# EasyEDA Pro project ProPrj_smartmower_2025-07-31_08-52-16_2025-10-22.epro, board smartmower
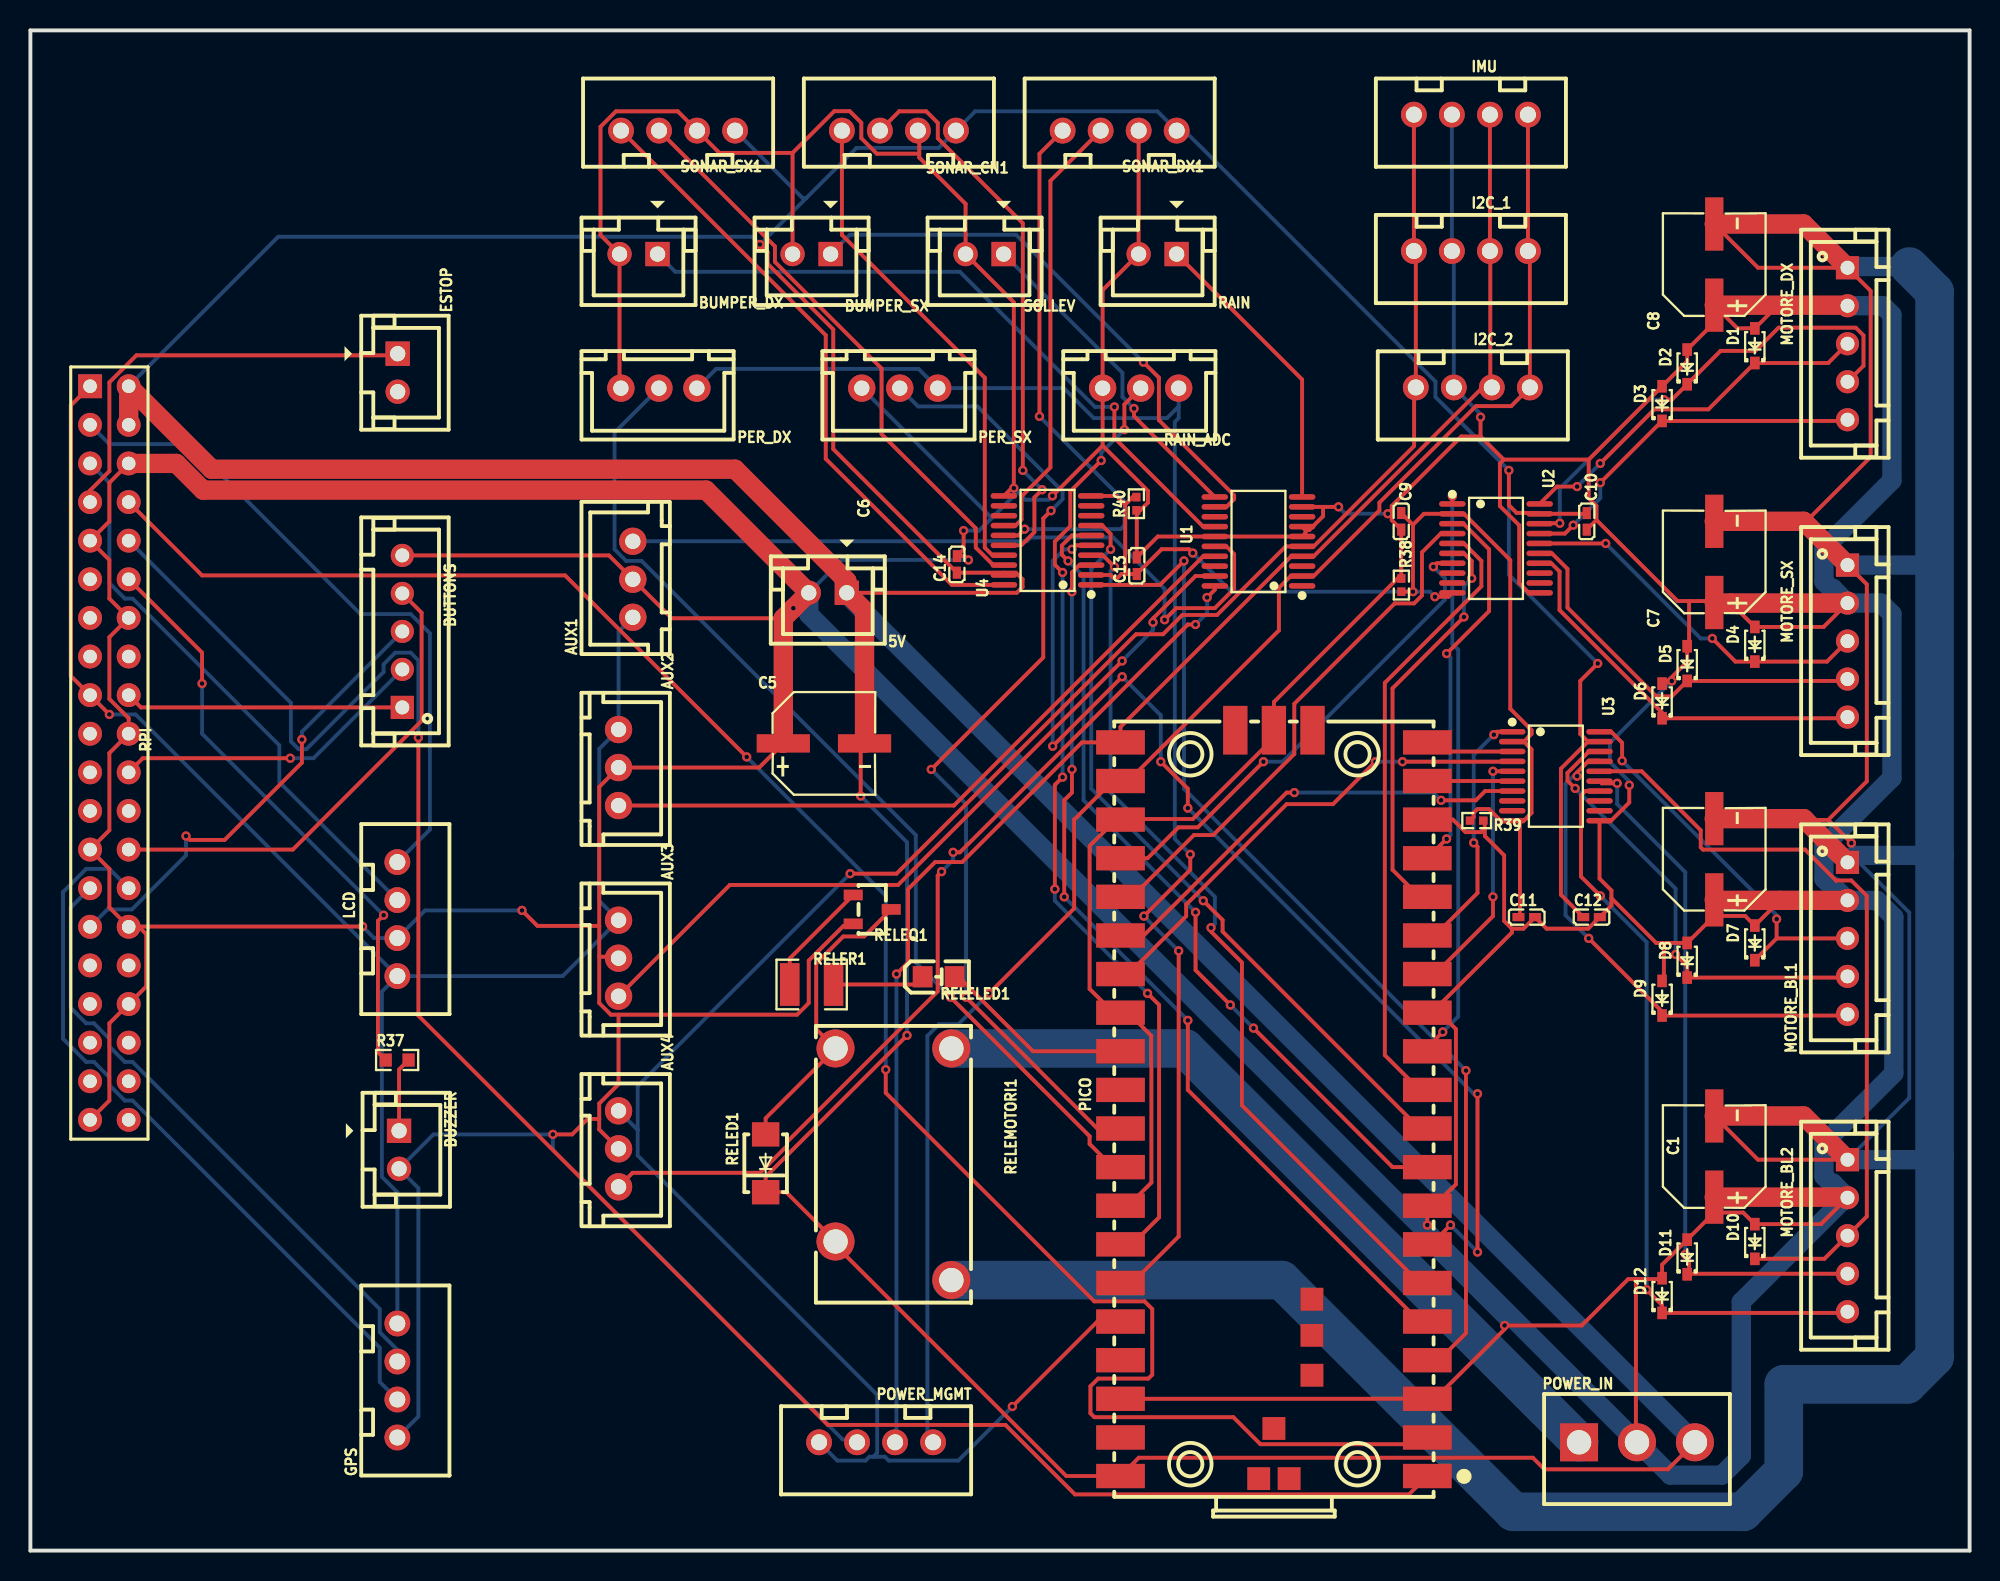
[diagram p4: board, top side]
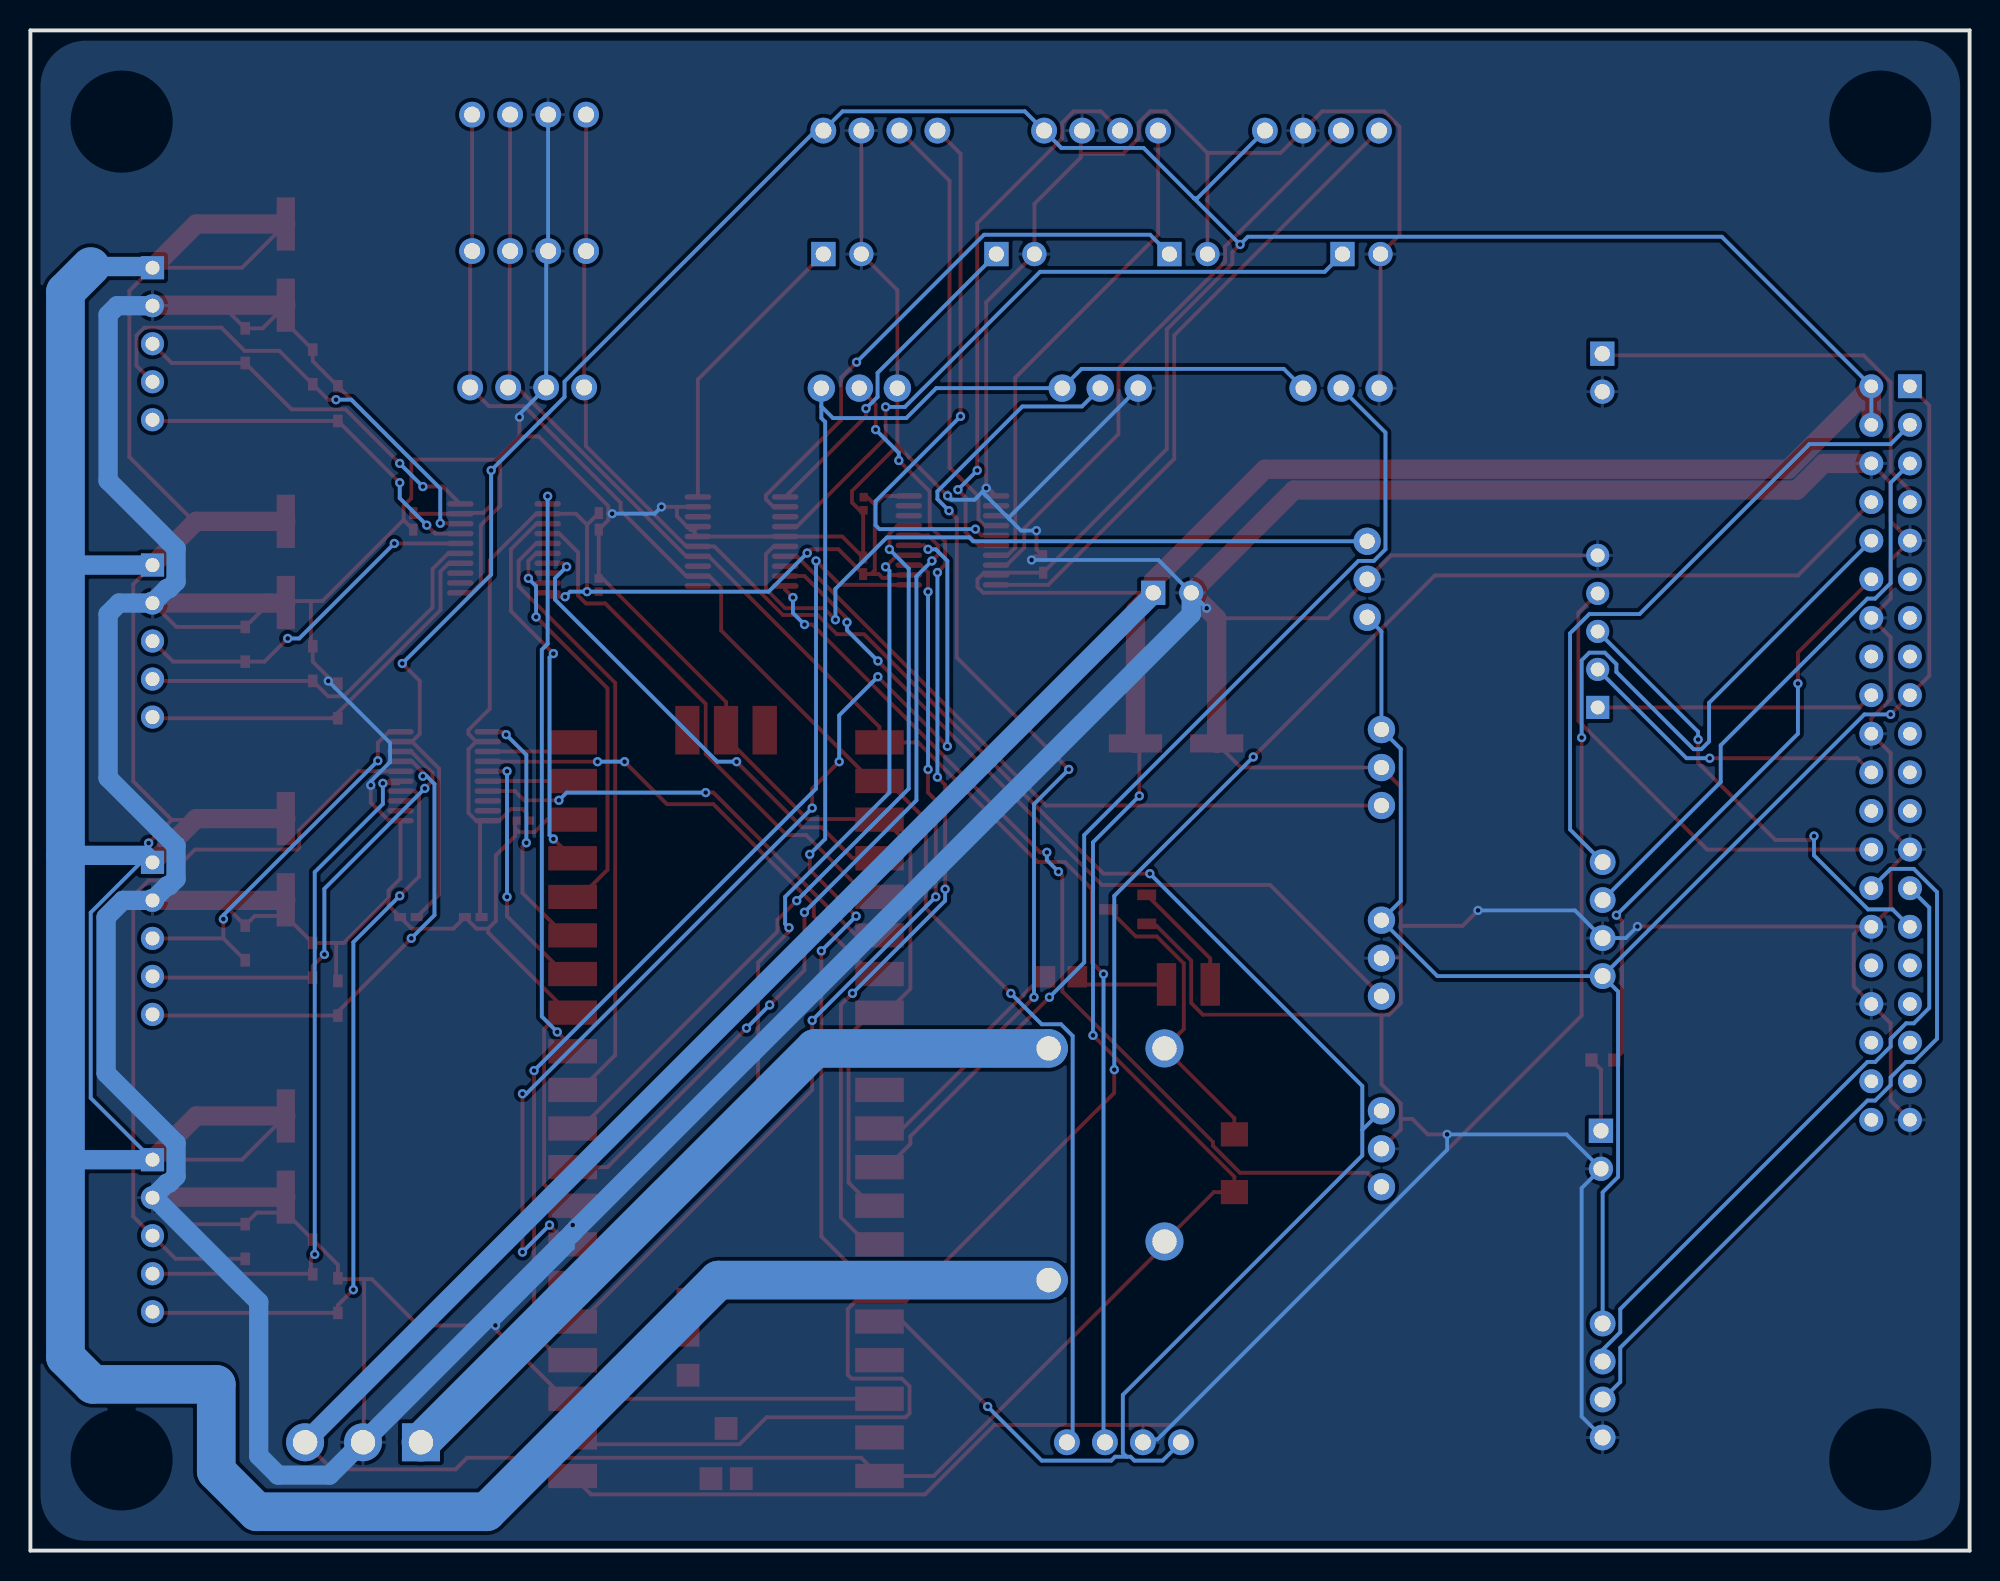
[diagram p5: board, bottom side, seen from below]

Outline 127.52 x 100 mm; copper layers: Top Layer, Bottom Layer. Coordinates in mm from the lower left corner of the outline.
Outline path: 0,100 127.52,100 127.52,0 0,0 0,100
Stack: Top Layer 0.035mm / Dielectric1 1.51mm FR4 er 4.5 / Bottom Layer 0.035mm

## Design rules (mm)
template: JLCPCB Capability(Two Layers Board)
spacing copperThickness1oz (default): track to track 0.102, other pairs 0.152 to 0.3
spacing copperThickness2oz: track to track 0.203, other pairs 0.152 to 0.3
track width copperThickness1oz (default): min 0.127, default 0.254, max 2.54
track width copperThickness2oz: min 0.203, default 0.254, max 2.54
differential pair differentialPair (default): width min 0.127, default 0.254, max 2.54; gap min 0.152, default 0.152
via viaSize (default): diameter min 0.5, default 0.61, max 10; hole min 0.3, default 0.305, max 6.3

## Placement (name value [footprint] x y rotation side)
5V  5V_OUT  [CONN-TH_2P-P2.50_CNJM_CNJMA2501WV-2P]  52.44 63 180 top
AUX1  Aux  [CONN-TH_XH-3A]  39.62 63.89 90 top
AUX2  Aux  [CONN-TH_XH-3A]  38.68 51.51 270 top
AUX3  Aux  [CONN-TH_XH-3A]  38.68 38.97 270 top
AUX4  Aux  [CONN-TH_XH-3A]  38.68 26.43 270 top
BUMPER_DX  BUMPER  [CONN-TH_2P-P2.50_CNJM_CNJMA2501WV-2P]  39.99 85.29 180 top
BUMPER_SX  BUMPER  [CONN-TH_2P-P2.50_CNJM_CNJMA2501WV-2P]  51.37 85.29 180 top
BUTTONS  Pulsanti  [CONN-TH_5P-P2.50_CNJM_CNJMA2501WV-5P]  24.46 60.47 270 top
BUZZER  Buzzer  [CONN-TH_2P-P2.50_CNJM_CNJMA2501WV-2P]  24.24 26.36 270 top
C1  47uF  [CAP-SMD_BD6.3-L6.6-W6.6-LS7.2-FD]  110.73 25.92 90 top
C5  47uF  [CAP-SMD_BD6.3-L6.6-W6.6-LS7.2-FD]  52.18 53.1 0 top
C6  47uF  [CAP-SMD_BD6.3-L6.6-W6.6-LS7.2-FD]  110.73 45.48 90 top
C7  47uF  [CAP-SMD_BD6.3-L6.6-W6.6-LS7.2-FD]  110.73 65.04 90 top
C8  47uF  [CAP-SMD_BD6.3-L6.6-W6.6-LS7.2-FD]  110.73 84.59 90 top
C9  C0402A471J500NT  [C0402]  90.14 67.71 270 top
C10  C0402A471J500NT  [C0402]  102.35 67.7 270 top
C11  C0402A471J500NT  [C0402]  98.4 41.67 0 top
C12  C0402A471J500NT  [C0402]  102.66 41.67 0 top
C13  C0402A471J500NT  [C0402]  72.76 64.78 90 top
C14  C0402A471J500NT  [C0402]  60.92 64.87 90 top
D1  1N5817WS SJ  [SOD-323_L1.7-W1.3-LS2.6-RD-1]  113.4 79.26 90 top
D2  1N5817WS SJ  [SOD-323_L1.7-W1.3-LS2.6-RD-1]  108.95 77.86 90 top
D3  1N5817WS SJ  [SOD-323_L1.7-W1.3-LS2.6-RD-1]  107.3 75.45 90 top
D4  1N5817WS SJ  [SOD-323_L1.7-W1.3-LS2.6-RD-1]  113.4 59.62 90 top
D5  1N5817WS SJ  [SOD-323_L1.7-W1.3-LS2.6-RD-1]  108.95 58.35 90 top
D6  1N5817WS SJ  [SOD-323_L1.7-W1.3-LS2.6-RD-1]  107.3 55.89 90 top
D7  1N5817WS SJ  [SOD-323_L1.7-W1.3-LS2.6-RD-1]  113.4 39.98 90 top
D8  1N5817WS SJ  [SOD-323_L1.7-W1.3-LS2.6-RD-1]  108.95 38.83 90 top
D9  1N5817WS SJ  [SOD-323_L1.7-W1.3-LS2.6-RD-1]  107.3 36.33 90 top
D10  1N5817WS SJ  [SOD-323_L1.7-W1.3-LS2.6-RD-1]  113.4 20.33 90 top
D11  1N5817WS SJ  [SOD-323_L1.7-W1.3-LS2.6-RD-1]  108.95 19.32 90 top
D12  1N5817WS SJ  [SOD-323_L1.7-W1.3-LS2.6-RD-1]  107.3 16.78 90 top
ESTOP  estop  [CONN-TH_2P-P2.50_CNJM_CNJMA2501WV-2P]  24.15 77.48 270 top
GPS  gps  [CONN-TH_4P-P2.50-XH2.54-4P]  24.13 11.19 90 top
I2C_1  i2c  [CONN-TH_4P-P2.50-XH2.54-4P]  94.73 85.49 0 top
I2C_2  i2c  [CONN-TH_4P-P2.50-XH2.54-4P]  94.85 76.51 0 top
IMU  i2c  [CONN-TH_4P-P2.50-XH2.54-4P]  94.73 94.46 0 top
LCD  i2c  [CONN-TH_4P-P2.50-XH2.54-4P]  24.13 41.54 90 top
MOTORE_BL1  Motore BL1  [CONN-TH_5P-P2.50_CNJM_CNJMA2501WV-5P]  119.49 40.27 90 top
MOTORE_BL2  Motore BL2  [CONN-TH_5P-P2.50_CNJM_CNJMA2501WV-5P]  119.49 20.71 90 top
MOTORE_DX  Motore DX  [CONN-TH_5P-P2.50_CNJM_CNJMA2501WV-5P]  119.49 79.39 90 top
MOTORE_SX  Motore SX  [CONN-TH_5P-P2.50_CNJM_CNJMA2501WV-5P]  119.49 59.83 90 top
PER_DX  Perimetro DX  [CONN-TH_XH-3A]  41.33 76.47 180 top
PER_SX  Perimetro SX  [CONN-TH_XH-3A]  57.17 76.47 180 top
PICO  PICO  [COMM-SMD_L51.0-W21.0-P2.54_SC0916]  81.77 29.35 90 top
POWER_IN  DB2EVC-3.81-3P-GN  [CONN-TH_3P-P3.81_DB2EVC-3.81-3P]  105.65 7.12 0 top
POWER_MGMT  i2c  [CONN-TH_4P-P2.50-XH2.54-4P]  55.61 7.12 0 top
R37  220  [R0603]  24.11 32.27 0 top
R38  10kΩ  [R0402]  90.15 63.51 270 top
R39  10kΩ  [R0402]  95.11 48.02 180 top
R40  10kΩ  [R0402]  72.73 68.87 90 top
RAIN  Rain  [CONN-TH_2P-P2.50_CNJM_CNJMA2501WV-2P]  74.13 85.29 180 top
RAIN_ADC  Rain ADC  [CONN-TH_XH-3A]  73.01 76.47 180 top
RELED1  1N4007F  [SMAF_L3.5-W2.6-LS4.7-RD]  48.35 25.48 90 top
RELELED1  ERR  [LED0805-FD]  59.73 37.75 180 top
RELEMOTORI1  HRS3FNH-S-DC5V-A  [RELAY-TH_HRS3FNH-X-X-A]  56.75 25.41 270 top
RELEQ1  S8050_C2146  [SOT-23-3_L3.0-W1.7-P0.95-LS2.9-BR]  55.36 42.18 180 top
RELER1  1.5kΩ  [R1210]  51.37 37.24 0 top
RPI  Raspberry Pi 5  [HDR-20X2/2.54]  6.46 53.73 270 top
SOLLEV  Sollevamento  [CONN-TH_2P-P2.50_CNJM_CNJMA2501WV-2P]  62.75 85.29 180 top
SONAR_CN1  SONAR CN  [CONN-TH_4P-P2.50-XH2.54-4P]  57.11 93.41 180 top
SONAR_DX1  SONAR DX  [CONN-TH_4P-P2.50-XH2.54-4P]  71.63 93.41 180 top
SONAR_SX1  SONAR SX  [CONN-TH_4P-P2.50-XH2.54-4P]  42.59 93.41 180 top
U1  PCF8574PWR  [TSSOP-20_L6.5-W4.4-P0.65-LS6.4-BL]  80.76 66.38 90 top
U2  TXS0108EPWR  [TSSOP-20_L6.5-W4.4-P0.65-LS6.4-BL]  96.38 65.93 270 top
U3  TXS0108EPWR  [TSSOP-20_L6.5-W4.4-P0.65-LS6.4-BL]  100.32 50.94 270 top
U4  TXS0108EPWR  [TSSOP-20_L6.5-W4.4-P0.65-LS6.4-BL]  66.89 66.45 90 top

## Footprints (pads in the part's own frame, mm; a bottom-side part is the same pattern mirrored in y, then rotated)
C0402
  rect 0.79x0.54 smd: 1(-0.545,0) 2(0.545,0)
CAP-SMD_BD6.3-L6.6-W6.6-LS7.2-FD
  rect 3.5x1.2 smd: 1(-2.67,0) 2(2.67,0)
COMM-SMD_L51.0-W21.0-P2.54_SC0916
  rect 1.6x3.2 smd: 1(-24.445,-10.088) 2(-21.905,-10.088) 3(-19.365,-10.088) 4(-16.825,-10.088) 5(-14.285,-10.088) 6(-11.745,-10.088) 7(-9.205,-10.088) 8(-6.665,-10.088) 9(-4.125,-10.088) 10(-1.585,-10.088) 11(0.955,-10.088) 12(3.495,-10.088) 13(6.035,-10.088) 14(8.575,-10.088) 15(11.115,-10.088) 16(13.655,-10.088) 17(16.195,-10.088) 18(18.735,-10.088) 19(21.275,-10.088) 20(23.815,-10.088) 21(23.815,10.088) 22(21.275,10.088) 23(18.735,10.088) 24(16.195,10.088) 25(13.655,10.088) 26(11.115,10.088) 27(8.575,10.088) 28(6.035,10.088) 29(3.495,10.088) 30(0.955,10.088) 31(-1.585,10.088) 32(-4.125,10.088) 33(-6.665,10.088) 34(-9.205,10.088) 35(-11.745,10.088) 36(-14.285,10.088) 37(-16.825,10.088) 38(-19.365,10.088) 39(-21.905,10.088) 40(-24.445,10.088)
  rect 3.2x1.6 smd: 41(24.615,-2.54) 42(24.615,0) 43(24.615,2.54)
  rect 1.5x1.5 smd: TP1(-21.315,0) TP2(-24.615,1) TP3(-24.615,-1) TP4(-17.815,-2.5) TP5(-15.188,-2.5) TP6(-12.815,-2.5)
CONN-TH_2P-P2.50_CNJM_CNJMA2501WV-2P
  rect 1.6x1.6 hole 1: 1(-1.25,0)
  round 1.6 hole 1: 2(1.25,0)
CONN-TH_3P-P3.81_DB2EVC-3.81-3P
  rect 2.5x2.5 hole 1.6: 1(-3.81,0)
  round 2.5 hole 1.6: 2(0,0) 3(3.81,0)
CONN-TH_4P-P2.50-XH2.54-4P
  round 1.7 hole 1.05: 1(3.75,0) 2(1.25,0) 3(-1.25,0) 4(-3.75,0)
CONN-TH_5P-P2.50_CNJM_CNJMA2501WV-5P
  rect 1.524x1.524 hole 0.914: 1(5,0)
  round 1.524 hole 0.914: 2(2.5,0) 3(0,0) 4(-2.5,0) 5(-5,0)
CONN-TH_XH-3A
  round 1.8 hole 1: 1(-2.5,0) 2(0,0) 3(2.5,0)
HDR-20X2/2.54
  rect 1.575x1.575 hole 0.889: 1(-22.86,-2.54)
  round 1.575 hole 0.889: 2(-22.86,0) 3(-20.32,-2.54) 4(-20.32,0) 5(-17.78,-2.54) 6(-17.78,0) 7(-15.24,-2.54) 8(-15.24,0) 9(-12.7,-2.54) 10(-12.7,0) 11(-10.16,-2.54) 12(-10.16,0) 13(-7.62,-2.54) 14(-7.62,0) 15(-5.08,-2.54) 16(-5.08,0) 17(-2.54,-2.54) 18(-2.54,0) 19(0,-2.54) 20(0,0) 21(2.54,-2.54) 22(2.54,0) 23(5.08,-2.54) 24(5.08,0) 25(7.62,-2.54) 26(7.62,0) 27(10.16,-2.54) 28(10.16,0) 29(12.7,-2.54) 30(12.7,0) 31(15.24,-2.54) 32(15.24,0) 33(17.78,-2.54) 34(17.78,0) 35(20.32,-2.54) 36(20.32,0) 37(22.86,-2.54) 38(22.86,0) 39(25.4,-2.54) 40(25.4,0)
LED0805-FD
  rect 1.3x1.399 smd: 1(-1.05,0) 2(1.05,0)
R0402
  rect 0.566x0.54 smd: 1(-0.433,0) 2(0.433,0)
R0603
  rect 0.806x0.864 smd: 1(-0.753,0) 2(0.753,0)
R1210
  rect 1.282x2.808 smd: 1(-1.441,0) 2(1.441,0)
RELAY-TH_HRS3FNH-X-X-A
  round 2.5 hole 1.6: 1(-7.62,-3.81) 2(5.08,-3.81) 3(7.62,3.81) 4(-7.62,3.81)
SMAF_L3.5-W2.6-LS4.7-RD
  rect 1.6x1.8 smd: 1(-1.9,0) 2(1.9,0)
SOD-323_L1.7-W1.3-LS2.6-RD-1
  rect 0.83x0.63 smd: 1(-1.14,0) 2(1.14,0)
SOT-23-3_L3.0-W1.7-P0.95-LS2.9-BR
  rect 1.25x0.7 smd: 1(1.25,-0.95) 2(1.25,0.95) 3(-1.25,0)
TSSOP-20_L6.5-W4.4-P0.65-LS6.4-BL
  oval 0.364x1.742 smd: 1(-2.925,-2.871) 2(-2.275,-2.871) 3(-1.625,-2.871) 4(-0.975,-2.871) 5(-0.325,-2.871) 6(0.325,-2.871) 7(0.975,-2.871) 8(1.625,-2.871) 9(2.275,-2.871) 10(2.925,-2.871) 11(2.925,2.871) 12(2.275,2.871) 13(1.625,2.871) 14(0.975,2.871) 15(0.325,2.871) 16(-0.325,2.871) 17(-0.975,2.871) 18(-1.625,2.871) 19(-2.275,2.871) 20(-2.925,2.871)

## Nets
As in the schematic.

Pads without a net: RPI 11 13 15 16 19 21 23 24 31 32 33 35 36 37 38 40; U1 1 3 8 13 18; U2 8 9 12 13; U3 8 9 12 13; U4 8 9 12 13

## Via types
v1: diameter 0.61, hole 0.305, Top Layer to Bottom Layer, 120 vias

## Routing (per net, layer and track width the routed paths; a pad name or vN(x,y) marks a point on that pad's centre or on a via; arc(x,y) is an arc through that point)
3.3VPICO: length 78.1
  Top Layer w0.254: 98.21,53.22 U3.2 ; 98.21,53.22 98.71,52.71 98.71,48.52 98.21,48.02 97.95,48.02 ; 98.21,53.22 98.71,53.72 98.71,53.98 97.32,55.37 97.32,65.15 94.27,68.2 91.64,68.2 90.92,67.48 ; U2.10 93.25,62.75 v1(92.36,62.75) ; 97.95,48.02 U3.10 96.68,48.02 95.92,48.78 95.16,48.78 94.9,48.52 94.9,48.25 R39.2 ; 97.95,48.02 97.95,41.77 C11.1 ; U4.2 71.04,64.18 71.23,63.98 71.49,63.98 71.74,64.24 72.25,64.24 ; 72.25,64.24 C13.1 74.39,65.87 76.18,65.87 v1(76.44,65.62) ; 72.25,64.24 71.99,64.49 71.99,68.81 ; 90.92,67.48 C9.1 ; 90.92,67.48 v1(90.92,63.08) R38.2 ; 71.99,68.81 72.48,69.3 R40.2 ; 71.99,68.81 71.43,69.38 U4.10
  Bottom Layer w0.254: v1(76.44,65.62) 78.98,63.08 v1(90.92,63.08) 92.03,63.08 v1(92.36,62.75)
5V: length 454.7
  Top Layer w0.254: 64.05,64.33 U4.19 ; 64.05,64.33 C14.1 52.8,72.46 52.8,80.33 48.48,84.65 48.48,85.41 v1(47.97,85.92) ; 64.05,64.33 64.81,64.33 65.24,63.89 65.24,63.39 64.86,63 5V.1 ; v1(97.22,71.06) 97.22,68.77 97.73,68.26 99.19,68.26 99.25,68.2 102.3,68.2 C10.1 ; 102.42,53.22 101.92,53.72 101.92,57.21 v1(103.07,58.36) ; 102.42,53.22 100.65,51.44 100.65,43.14 C12.1 ; 102.42,53.22 103.19,53.22 ; v1(57.65,33.89) 48.35,24.59 RELED1.1 49.7,23.58 RELEMOTORI1.2 52.94,20.08 68.12,4.91 PICO.40 72.89,6.11 98.8,6.11 99.56,5.35 107.68,5.35 POWER_IN.3 ; v1(54.6,49.64) 54.6,52.84 C5.2
  Top Layer w1.27: RPI.4 RPI.2 11.92,71.13 46.34,71.13 53.69,63.79 5V.1 54.85,61.84 C5.2
  Bottom Layer w0.254: v1(103.07,58.36) 97.22,64.2 v1(97.22,71.06) 92.4,75.88 92.4,76.9 75.89,93.41 SONAR_DX1.4 74.11,94.68 62.13,94.68 SONAR_CN1.4 59.72,92.27 54.32,92.27 51.02,88.97 ; SONAR_SX1.4 50.78,88.97 51.02,88.97 ; v1(54.6,49.64) 57.65,46.59 v1(57.65,33.89) ; RPI.4 RPI.2 16.29,86.43 47.46,86.43 v1(47.97,85.92) 51.02,88.97
  Bottom Layer w1.27: POWER_IN.3 53.69,62.9 5V.1
GND: length 987.8
  Top Layer w0.254: 70.51,72.68 73.49,69.7 73.49,68.94 72.98,68.43 R40.1 72.76,68.41 C13.2 74.14,66.71 U1.15 U1.6 83.85,66.93 83.85,67.13 ; 70.51,72.68 v1(67.21,69.38) ; 70.51,72.68 RAIN_ADC.3 70.51,82.92 RAIN.2 72.88,93.41 ; 92.15,35.39 PICO.13 ; 92.15,35.39 92.66,35.39 93.74,34.3 93.74,24.09 92.33,22.69 PICO.8 v1(91.86,21.41) ; 92.15,35.39 97.42,40.66 97.42,40.91 ; 83.85,67.13 U1.7 ; 83.85,67.13 84.1,67.13 85.01,68.04 85.01,68.66 ; 37.41,39.06 38.58,39.06 38.68,38.97 ; 37.41,39.06 37.41,41.1 ; 37.41,39.06 37.41,36.02 38.17,35.25 38.68,35.25 ; 50.12,91.94 45.31,91.94 SONAR_SX1.3 42.57,94.68 38.51,94.68 37.49,93.66 37.49,86.54 BUMPER_DX.2 38.74,76.56 PER_DX.3 ; 50.12,91.94 52.86,94.69 53.88,94.69 54.64,93.92 54.64,92.91 55.66,91.89 58.45,91.89 ; 50.12,91.94 BUMPER_SX.2 ; C5.1 47.92,51.51 AUX2.2 37.41,50.24 37.41,41.1 ; PICO.38 PICO.3 92.37,9.99 96.94,14.56 v1(96.94,14.81) 102.02,14.81 105.07,17.86 105.58,17.86 ; 38.68,35.25 38.68,30.68 37.41,29.41 37.41,28.4 ; 38.68,35.25 50.42,35.25 51.18,36.02 51.18,38.81 53.47,41.1 53.98,41.1 RELEQ1.2 ; POWER_IN.2 105.58,7.2 105.58,17.86 ; 58.45,91.89 58.45,91.64 61.5,88.59 SOLLEV.2 64.67,82.12 v1(64.67,69.89) 64.53,69.89 U4.11 ; 58.45,91.89 58.45,93.32 SONAR_CN1.3 ; 105.58,17.86 107.24,17.86 D12.2 107.3,18.81 D11.2 110.73,22.24 ; 95.64,47.51 95.64,47.92 R39.1 ; 95.64,47.51 95.39,47.26 94.37,47.26 93.55,48.08 PICO.18 ; 95.64,47.51 95.64,47.01 96.91,45.74 96.91,41.42 97.42,40.91 ; 103.97,42.92 103.97,42.43 C12.2 102.44,40.91 99.71,40.91 C11.2 98.18,40.91 97.42,40.91 ; 103.97,42.92 103.97,43.42 103.19,44.2 103.19,48.02 103.95,48.02 105.14,49.21 v1(105.14,50.34) ; 103.97,42.92 106.91,39.97 107.42,39.97 ; 107.42,39.97 D8.2 110.73,41.75 ; 107.42,39.97 107.42,37.59 D9.2 ; 109.08,62.46 108.32,62.46 102.98,67.79 ; 109.08,62.46 110.64,62.46 ; 109.08,62.46 109.08,59.62 D5.2 108.95,58.47 107.68,57.2 ; AUX4.2 37.41,27.7 37.41,28.4 ; 95.36,73.29 v1(95.36,74.56) ; 95.36,73.29 94.09,73.29 89.52,68.72 89.52,68.21 ; 95.36,73.29 96.89,71.77 ; 110.73,41.75 112.76,41.75 D7.2 115.05,42.77 ; 110.73,41.75 C6.1 ; 102.47,71.77 102.47,69.22 102.98,68.72 102.98,67.79 ; 102.47,71.77 D3.2 108.95,78.24 D2.2 110.73,80.78 C8.1 112.25,80.4 D1.2 114.88,81.89 ; 102.47,71.77 96.89,71.77 ; 107.68,57.2 107.51,57.03 D6.2 ; 107.68,57.2 v1(107.93,57.2) ; 89.52,68.21 v1(89.27,68.21) ; 89.52,68.21 89.52,67.79 C9.2 90.14,63.96 R38.1 89.9,63.95 81.77,55.82 PICO.42 81.77,53.46 76.44,48.12 71.72,48.12 ; 102.98,67.79 102.35,67.16 ; PICO.33 72.19,22.69 73.72,24.21 73.72,33.86 72.19,35.39 PICO.28 71.22,35.39 69.65,36.95 69.65,46.34 71.43,48.12 71.72,48.12 ; 85.01,68.66 U1.9 ; 85.01,68.66 v1(86.02,68.66) ; 110.73,22.24 C1.1 ; 110.73,22.24 112.63,22.24 D10.2 117.75,21.47 MOTORE_BL2.2 ; MOTORE_SX.2 117.92,60.76 D4.2 111.82,62.33 111.79,62.37 ; 37.41,41.1 33.34,41.1 v1(32.33,42.11) ; 71.72,48.12 PICO.23 ; 37.41,28.4 36.64,28.4 35.63,27.38 v1(34.36,27.38) ; v1(61.37,67.1) 61.37,65.86 C14.2 61.43,65.42 v1(61.69,65.16) ; 96.89,71.77 96.63,71.51 96.63,68.72 97.9,67.45 97.9,63.64 98.54,63 U2.11 ; v1(21.84,41.05) 7.11,41.05 ; 7.11,41.05 7.62,40.55 7.62,37.11 RPI.34 5.19,34.68 5.19,29.6 RPI.39 ; 7.11,41.05 6.48,41.05 RPI.30 5.19,42.3 5.19,44.84 RPI.25 5.19,47.38 5.19,52.46 RPI.20 6.46,54.75 5.19,56.02 5.19,60.08 RPI.14 5.19,62.62 5.19,65.16 RPI.9 5.19,67.7 5.19,70.24 RPI.6 ; 49.51,61.33 42.18,61.33 AUX1.2 38.04,65.47 BUTTONS.5
  Top Layer w1.27: RPI.6 9.6,71.51 11.35,69.76 44.43,69.76 5V.2 v1(50.17,61.99) 49.51,61.33 C5.1 ; MOTORE_BL1.2 110.77,42.77 C6.1 ; C1.1 119.45,23.25 MOTORE_BL2.2 ; C8.1 119.45,81.92 MOTORE_DX.2 ; C7.1 110.77,62.33 MOTORE_SX.2
  Bottom Layer w0.254: 64.92,69.64 63.14,67.86 ; 64.92,69.64 v1(64.67,69.89) ; 64.92,69.64 65.43,69.13 66.95,69.13 v1(67.21,69.38) ; 63.14,67.86 62.38,67.1 v1(61.37,67.1) ; 63.14,67.86 63.14,67.99 PER_SX.3 ; v1(89.27,68.21) 86.47,68.21 v1(86.02,68.66) ; v1(91.86,21.41) 91.86,19.89 v1(96.94,14.81) ; v1(61.69,65.16) 53.35,65.16 5V.2 v1(50.17,61.99) ; v1(107.93,57.2) 103.87,53.14 103.87,51.87 105.14,50.6 v1(105.14,50.34) ; IMU.3 I2C_1.3 93.6,85.36 I2C_2.3 95.36,74.76 v1(95.36,74.56) ; POWER_MGMT.3 54.17,7.32 53.41,7.32 34.36,26.37 v1(34.36,27.38) 26.51,27.38 BUZZER.2 25.51,23.84 25.51,8.82 GPS.4 ; v1(21.84,41.05) 22.61,40.29 LCD.3 25.95,42.11 v1(32.33,42.11)
  Bottom Layer w1.27: 5V.2 51.19,61.59 POWER_IN.2 106.03,6.74 106.07,6.74 107.85,4.97 111.24,4.97 112.51,6.24 112.51,16.36 119.36,23.21 MOTORE_BL2.2 118.54,24.16 118.4,24.16 117.94,24.63 117.94,26.8 122.54,31.4 122.54,41.67 121.44,42.77 MOTORE_BL1.2 118.54,43.72 118.4,43.72 117.94,44.18 117.94,46.36 122.41,50.83 122.41,61.61 121.69,62.33 MOTORE_SX.2 118.54,63.28 118.4,63.28 117.94,63.74 117.94,65.92 122.41,70.39 122.41,81.29 121.82,81.89 MOTORE_DX.2
VIN_24V_RELE_IN: length 52
  Bottom Layer w2.54: POWER_IN.1 75.93,33.03 RELEMOTORI1.4
VIN_24V_RELE_OUT: length 297.6
  Top Layer w0.254: v1(119.75,46.54) 118.22,48.07 ; 118.22,48.07 120.76,50.61 120.76,63.56 MOTORE_SX.1 ; 118.22,48.07 116.7,48.07 ; MOTORE_BL2.1 113.61,25.71 C1.2 ; C8.2 113.61,84.39 MOTORE_DX.1 121.02,82.86 121.02,71.94 116.7,67.62 ; 110.81,67.62 C7.2 ; 110.81,48.07 C6.2
  Top Layer w1.27: MOTORE_DX.1 116.61,87.27 C8.2 ; C6.2 116.61,48.15 MOTORE_BL1.1 ; MOTORE_BL2.1 116.61,28.59 C1.2 ; C7.2 116.61,67.71 MOTORE_SX.1
  Bottom Layer w0.254: MOTORE_BL2.1 123.56,29.78 123.56,41.97 120.25,45.27 ; 119.75,45.27 v1(119.75,46.54)
  Bottom Layer w1.27: MOTORE_SX.1 124.87,64.83 124.95,64.91 ; MOTORE_BL2.1 125,25.71 125.46,26.17 ; 123.56,84.47 119.57,84.47 ; MOTORE_BL1.1 119.95,45.73 125.22,45.73
  Bottom Layer w2.54: RELEMOTORI1.3 82.28,17.79 97.52,2.55 112.63,2.55 115.3,5.22 115.3,10.94 123.42,10.94 125.22,12.73 125.22,82.81 123.56,84.47
AUX1: length 47.7
  Top Layer w0.254: U1.16 78.65,66.06 79.16,65.55 79.16,63.26 77.89,61.99 75.35,61.99 v1(74.58,61.23)
  Bottom Layer w0.254: v1(74.58,61.23) 74.58,63.26 71.2,66.65 65.78,66.65 65.52,66.39 AUX1.3
AUX2: length 46
  Top Layer w0.254: AUX2.3 60.73,49.01 77.12,65.41 U1.17
AUX3: length 51.1
  Top Layer w0.254: AUX3.3 45.99,43.79 57.06,43.79 v1(71.79,58.52) ; U1.19 76.62,64.11 73.82,61.31 v1(73.82,61.06)
  Bottom Layer w0.254: v1(73.82,61.06) 73.82,60.55 v1(71.79,58.52)
AUX4: length 61.2
  Top Layer w0.254: AUX4.3 39.6,24.85 47.98,24.85 49.76,26.63 49.76,26.88 59.66,36.79 59.66,44.41 v1(59.92,44.66) ; v1(60.68,45.93) 61.12,45.93 76.11,60.92 v1(76.62,60.92) ; U1.20 77.89,63.2 v1(77.38,62.7)
  Bottom Layer w0.254: v1(60.68,45.93) 60.68,45.42 v1(59.92,44.66) ; v1(77.38,62.7) 77.38,61.68 v1(76.62,60.92)
BLA_LEFT_DIR: length 5.6
  Top Layer w0.254: U3.6 97.43,50.62 PICO.19
BLA_LEFT_ENC: length 30.1
  Top Layer w0.254: PICO.26 73.21,40.47 82.61,49.86 v1(83.12,49.86) ; v1(92.77,49.36) 95.05,49.36 95.66,49.97 U3.7
  Bottom Layer w0.254: v1(92.77,49.36) 92.26,49.86 v1(83.12,49.86)
BLA_LEFT_PWM: length 16.7
  Top Layer w0.254: PICO.14 92.37,37.92 96.18,41.73 v1(96.18,43) ; v1(96.18,51.27) U3.5
  Bottom Layer w0.254: v1(96.18,43) v1(96.18,51.27)
BLA_RIGHT_DIR: length 5.8
  Top Layer w0.254: PICO.20 92.46,52.56 U3.3
BLA_RIGHT_ENC: length 32
  Top Layer w0.254: v1(90.23,51.89) 97.42,51.89 97.44,51.92 ; v1(88.45,51.89) 85.66,49.1 82.61,49.1 76,42.5 76,41.73 72.19,37.92 PICO.27
  Bottom Layer w0.254: v1(88.45,51.89) v1(90.23,51.89)
BLA_RIGHT_PWM: length 16.8
  Top Layer w0.254: v1(96.24,53.67) 96.43,53.86 U3.1 ; v1(94.91,46.56) 95.16,46.31 95.16,43.26 92.37,40.47 PICO.15
  Bottom Layer w0.254: v1(96.24,53.67) 94.91,52.35 v1(94.91,46.56)
BUMPER_DX: length 45.3
  Top Layer w0.254: v1(71.28,75.23) 71.28,73.2 77.12,67.36 U1.14
  Bottom Layer w0.254: v1(71.28,75.23) 70.01,75.23 61.12,84.12 42.4,84.12 BUMPER_DX.1
BUMPER_SX: length 37.5
  Top Layer w0.254: v1(73.19,78.18) 74.21,77.16 74.21,74.37 79.16,69.42 79.16,69.16 78.65,68.66 U1.12
  Bottom Layer w0.254: BUMPER_SX.1 53.89,86.56 64.81,86.56 v1(73.19,78.18)
BUZZER: length 38.9
  Top Layer w0.254: v1(23.23,41.8) 22.85,41.42 22.85,32.78 R37.1 ; v1(11.29,57.04) 11.29,59.07 RPI.12
  Bottom Layer w0.254: v1(23.23,41.8) 11.29,53.73 v1(11.29,57.04)
ECHO_CENTER: length 73.9
  Top Layer w0.254: U4.5 68.76,66.13 v1(68.49,65.86) ; v1(76.11,48.85) 76.11,50.12 v1(74.33,51.89) ; v1(71.79,57.48) v1(67.22,52.91) ; v1(95.16,19.64) v1(95.16,30.05) ; v1(93.38,21.41) 92.11,20.15 PICO.7
  Bottom Layer w0.254: v1(68.49,65.86) 67.98,65.86 67.22,65.1 v1(67.22,52.91) ; v1(93.38,21.41) v1(95.16,19.64) ; v1(71.79,57.48) 74.33,54.94 v1(74.33,51.89) ; v1(95.16,30.05) 94.91,30.05 v1(76.11,48.85)
ECHO_LEFT: length 61.2
  Top Layer w0.254: PICO.5 91.35,15.06 76.11,30.31 v1(76.11,34.88) ; v1(68.49,51.39) 68.49,49.86 67.98,49.36 v1(67.98,43) ; v1(68.49,63.07) 68.49,64.34 69,64.85 69.74,64.85 U4.3
  Bottom Layer w0.254: v1(76.11,34.88) v1(67.98,43) ; v1(68.49,51.39) v1(68.49,63.07)
ECHO_RIGHT: length 50.6
  Top Layer w0.254: v1(71.03,65.86) 71.03,66.88 70.52,67.39 69.8,67.39 U4.7 ; PICO.10 91.35,27.77 78.4,40.72 78.4,41.48 v1(77.13,42.75)
  Bottom Layer w0.254: v1(77.13,42.75) 69.76,50.12 69.76,64.59 v1(71.03,65.86)
EMER_STOP: length 28.1
  Top Layer w0.254: ESTOP.1 24.05,78.63 6.97,78.63 5.19,76.85 5.19,71.01 3.92,69.74 RPI.7
GIU_BUTTON: length 30.7
  Top Layer w0.254: v1(17.85,53.35) 17.85,51.83 12.77,46.75 10.49,46.75 v1(10.23,47)
  Bottom Layer w0.254: BUTTONS.3 17.85,53.86 v1(17.85,53.35) ; RPI.29 5.06,42.18 6.68,42.18 10.23,45.73 v1(10.23,47)
GPS_RX: length 41.2
  Bottom Layer w0.254: RPI.27 2.65,42.3 2.65,35.7 3.67,34.68 4.18,34.68 5.19,33.67 5.19,33.16 6.21,32.14 6.72,32.14 22.97,15.89 22.97,14.36 24.13,13.21 GPS.2
GPS_TX: length 48.6
  Bottom Layer w0.254: RPI.28 5.19,44.84 3.67,44.84 2.14,43.32 2.14,33.67 3.67,32.14 4.18,32.14 5.19,31.13 5.19,30.62 6.21,29.6 6.72,29.6 22.97,13.35 22.97,11.1 GPS.3
LIFT: length 21.7
  Top Layer w0.254: U1.11 72.57,74.62 v1(72.57,75.13)
  Bottom Layer w0.254: SOLLEV.1 71.81,77.47 71.81,75.89 v1(72.57,75.13)
MOT_LEFT_DIR: length 27
  Top Layer w0.254: PICO.16 91.35,43 89.57,44.78 89.57,56.72 v1(94.27,61.42) ; v1(94.78,63.96) 94.78,65.09 94.27,65.6 U2.6
  Bottom Layer w0.254: v1(94.78,63.96) 94.27,63.45 v1(94.27,61.42)
MOT_LEFT_ENC: length 32.2
  Top Layer w0.254: v1(81.08,51.89) 76.77,47.58 75.5,47.58 73.46,45.55 PICO.24 ; U2.7 92.49,64.95 v1(92.26,64.72)
  Bottom Layer w0.254: v1(81.08,51.89) 82.35,51.89 93.02,62.56 93.02,63.96 v1(92.26,64.72)
MOT_LEFT_PWM: length 41.3
  Top Layer w0.254: PICO.11 91.35,30.31 89.07,32.59 89.07,57.08 95.42,63.43 95.42,65.1 94.27,66.25 U2.5
MOT_RIGHT_DIR: length 25.3
  Top Layer w0.254: v1(93.13,59.01) 95.92,61.8 95.92,65.86 94.24,67.55 U2.3 ; PICO.17 v1(93.13,46.81)
  Bottom Layer w0.254: v1(93.13,59.01) 93.38,58.75 93.38,47.07 v1(93.13,46.81)
MOT_RIGHT_ENC: length 35.3
  Top Layer w0.254: PICO.25 72.45,43 76.51,47.07 77.78,47.07 83.12,52.4 83.12,55.7 89.72,62.31 90.99,62.31 91.51,62.83 91.51,65.67 92.74,66.9 U2.4
MOT_RIGHT_PWM: length 38
  Top Layer w0.254: v1(93.51,69.36) U2.1 ; PICO.12 91.86,33.1 v1(92.88,34.11)
  Bottom Layer w0.254: v1(93.51,69.36) 93.51,59.65 93.89,59.26 93.89,35.13 v1(92.88,34.11)
PERIMETRO_DX: length 67.1
  Top Layer w0.254: v1(60.51,36.4) 69.65,27.26 69.65,26.75 71.18,25.22 PICO.32
  Bottom Layer w0.254: v1(60.51,36.4) 58.22,38.69 58.22,47.07 40.19,65.1 39.17,65.1 38.41,65.86 38.41,73.55 PER_DX.2
PERIMETRO_SX: length 65.1
  Top Layer w0.254: v1(67.11,68.41) 66.61,67.9 66.61,58.75 v1(59.24,51.39) ; PICO.31 70.16,27.77 v1(61.53,36.4)
  Bottom Layer w0.254: v1(67.11,68.41) 67.88,69.17 67.88,69.67 62.29,75.26 58.37,75.26 PER_SX.2 ; v1(59.24,51.39) 61.53,49.1 v1(61.53,36.4)
PICO_3V3_OUT: length 147.5
  Top Layer w0.254: v1(64.57,9.48) 70.16,15.06 PICO.36 ; v1(53.91,44.53) 56.95,44.53 72.7,60.28 74.48,60.28 75.75,61.55 78.04,61.55 82.55,66.06 U1.5 84.39,66.06 90.99,72.66 90.99,76.4 I2C_2.4 91.1,85.36 I2C_1.4 IMU.4
  Bottom Layer w0.254: 55.43,6.18 56.19,6.18 56.45,5.92 61.02,5.92 v1(64.57,9.48) ; 55.43,6.18 55.18,6.18 54.92,5.92 53.07,5.92 POWER_MGMT.4 ; 55.43,6.18 55.68,6.43 55.68,10.24 39.94,25.99 39.94,27.67 ; 39.94,27.67 39.94,30.56 v1(53.91,44.53) ; 39.94,27.67 AUX4.1
PICO_ADC_VREF: length 97.5
  Top Layer w0.254: PICO.35 72.45,17.6 75.51,20.67 v1(75.51,39.45) ; v1(76.27,45.8) 76.27,44.78 v1(73.22,41.73)
  Bottom Layer w0.254: 75.51,75.26 RAIN_ADC.1 ; 75.51,75.26 75.51,74.5 75.26,74.25 75.26,46.81 v1(76.27,45.8) ; 75.51,75.26 74.75,74.5 69.92,74.5 67.96,76.47 PER_SX.1 58.4,77.74 45.1,77.74 PER_DX.1 ; v1(75.51,39.45) v1(73.22,41.73)
PICO_RX: length 130.5
  Top Layer w0.254: RPI.8 11.29,64.15 35.16,64.15 v1(47.1,52.21) ; v1(56.25,31.64) 56.25,30.11 69.96,16.4 73.26,16.4 73.77,15.89 73.77,11.57 73.52,11.32 70.22,11.32 69.71,10.81 69.71,9.03 69.96,8.78 79.11,8.78 80.88,7 91.41,7 PICO.2
  Bottom Layer w0.254: v1(56.25,31.64) 56.25,43.07 v1(47.1,52.21)
PICO_TX: length 132.6
  Top Layer w0.254: v1(25.51,53.48) 25.51,35.19 52.44,8.27 64.12,8.27 68.69,3.7 90.65,3.7 PICO.1
  Bottom Layer w0.254: v1(25.51,53.48) 25.51,58.56 25,59.07 23.99,59.07 23.23,58.31 23.23,57.8 18.15,52.72 17.64,52.72 17.13,53.23 17.13,55.77 RPI.10
PWR_RELE: length 12.9
  Top Layer w0.254: RELELED1.1 61.03,37.75 65.93,32.84 PICO.29
RAIN: length 19.4
  Top Layer w0.254: U1.10 83.63,77.04 RAIN.1
RAIN_ADC: length 63.4
  Top Layer w0.254: PICO.34 72.45,20.15 74.23,21.92 74.23,35.89 v1(73.46,36.66) ; v1(67.37,43.51) 67.37,50.37 v1(67.88,50.88) ; v1(70.42,71.71) 68.38,69.67 68.38,67.39 67.37,66.37 67.37,64.85 v1(67.88,64.34) ; RAIN_ADC.2 71.94,75.4 v1(71.94,73.74)
  Bottom Layer w0.254: v1(70.42,71.71) 70.42,72.22 v1(71.94,73.74) ; v1(67.88,50.88) v1(67.88,64.34) ; v1(67.37,43.51) 67.37,42.75 v1(73.46,36.66)
RPI_3V3_OUT: length 110.4
  Top Layer w0.254: v1(5.19,55) RPI.17 2.65,57.54 2.65,75.32 RPI.1
  Bottom Layer w0.254: LCD.4 35,37.79 AUX3.1 37.41,42.74 37.41,52.74 AUX2.1 38.68,60.45 AUX1.1 ; LCD.4 23.11,36.78 23.11,24.58 24.13,23.57 GPS.1 ; LCD.4 6.92,55 v1(5.19,55)
SCL_PICO: length 107.5
  Top Layer w0.254: v1(63.05,36.66) 68.64,42.24 68.64,48.08 71.18,50.62 PICO.22 72.19,50.62 82.1,60.53 82.1,63.33 82.88,64.11 U1.2 84.39,64.11 88.71,68.43 88.71,68.93 95.06,75.28 97.37,75.28 I2C_2.1 98.6,85.36 I2C_1.1 IMU.1
  Bottom Layer w0.254: v1(63.05,36.66) 61.02,34.62 59.75,34.62 58.99,33.86 58.99,7.5 POWER_MGMT.1
SCL_RPI: length 37.4
  Bottom Layer w0.254: RPI.5 5.19,70.24 5.19,63.64 6.21,62.62 6.72,62.62 16.37,52.97 16.37,50.55 LCD.2
SDA_PICO: length 107.4
  Top Layer w0.254: 96,76.51 I2C_2.2 ; 96,76.51 96,85.46 I2C_1.2 IMU.2 ; 96,76.51 95.5,76.51 84.39,65.41 U1.4 82.91,65.41 71.69,54.18 PICO.21 69.15,53.17 61.27,45.29 59.49,45.29 57.72,43.51 57.72,38.69 v1(56.95,37.92)
  Bottom Layer w0.254: POWER_MGMT.2 56.95,7.22 v1(56.95,37.92)
SDA_RPI: length 44
  Bottom Layer w0.254: RPI.3 5.19,72.78 10.53,72.78 21.7,61.61 25,61.61 26.27,60.34 26.27,47.44 LCD.1
START_BUTTON: length 18.3
  Top Layer w0.254: RPI.18 7.27,55.47 BUTTONS.1
STOP_BUTTON: length 31.7
  Top Layer w0.254: BUTTONS.4 25.73,61.69 25.73,54.58 17.26,46.11 RPI.26
SU_BUTTON: length 20.8
  Top Layer w0.254: v1(17.09,52.12) 7.39,52.12 RPI.22
  Bottom Layer w0.254: v1(17.09,52.12) 18.61,52.12 BUTTONS.2
TRIG_CENTER: length 58.2
  Top Layer w0.254: v1(71.29,64.71) 70.52,65.48 U4.4 ; v1(77.64,40.97) 77.64,40.72 79.67,38.69 79.67,29.29 91.35,17.6 PICO.6
  Bottom Layer w0.254: v1(71.29,64.71) 71.03,64.46 71.03,49.86 77.89,43 77.89,41.23 v1(77.64,40.97)
TRIG_LEFT: length 68.5
  Top Layer w0.254: v1(75.86,65.1) 74.28,63.53 U4.1 ; PICO.4 92.62,12.53 94.4,14.3 v1(94.4,31.58)
  Bottom Layer w0.254: v1(94.4,31.58) 75.86,50.12 v1(75.86,65.1)
TRIG_RIGHT: length 54.4
  Top Layer w0.254: v1(68.24,65.1) 67.83,65.51 67.83,66.12 68.49,66.78 U4.6 ; v1(76.62,41.99) 76.62,38.18 v1(78.91,35.89) ; PICO.9 89.57,25.22 v1(80.43,34.37)
  Bottom Layer w0.254: v1(68.24,65.1) 69.25,64.09 69.25,49.36 v1(76.62,41.99) ; v1(80.43,34.37) v1(78.91,35.89)
$1N29: length 6.1
  Top Layer w0.254: RELELED1.2 58.17,37.24 RELER1.2
$1N30: length 7.6
  Top Layer w0.254: RELER1.1 49.93,38.95 RELEQ1.1
$1N33: length 20.1
  Top Layer w0.254: RELED1.2 48.35,28.44 RELEMOTORI1.1 51.67,34.3 51.67,38.62 53.45,40.4 54.83,40.4 RELEQ1.3
$1N51: length 42.3
  Top Layer w0.254: 38.84,93.41 52.3,79.95 52.3,71.82 60.59,63.53 U4.20
$1N53: length 38.4
  Top Layer w0.254: U4.18 63.32,64.83 62.17,65.98 62.17,67.25 55.97,73.44 55.97,77.76 48.96,84.77 48.96,85.79 SONAR_SX1.2
$1N27511: length 4.9
  Top Layer w0.254: BUZZER.1 24.24,31.64 R37.2
$1N32829: length 24.6
  Top Layer w0.254: v1(101.71,69.99) 100.39,69.99 U2.20 ; v1(103.24,71.52) 106.79,75.07 110.35,75.07 D1.1 118.23,78.12 MOTORE_DX.3
  Bottom Layer w0.254: v1(103.24,71.52) v1(101.71,69.99)
$1N32835: length 31.7
  Top Layer w0.254: U2.18 99.28,67.58 v1(100.57,67.58) ; v1(107.43,75.71) 107.93,75.71 D2.1 111.15,78.92 113.43,78.92 114.96,80.44 120.04,80.44 120.55,79.94 120.55,77.94 MOTORE_DX.4
  Bottom Layer w0.254: v1(100.57,67.58) 100.57,69.87 106.41,75.71 v1(107.43,75.71)
$1N32841: length 23.9
  Top Layer w0.254: MOTORE_DX.5 119.42,74.31 D3.1 v1(103.24,70.25) ; U2.17 100.91,66.9 v1(101.46,67.45)
  Bottom Layer w0.254: v1(101.46,67.45) 103.24,69.23 v1(103.24,70.25)
$1N33200: length 26.4
  Top Layer w0.254: U2.14 99.29,64.91 100.05,64.91 100.56,64.41 100.56,61.86 107.67,54.75 ; D6.1 107.67,54.75 ; 107.67,54.75 119.42,54.75 MOTORE_SX.5
$1N33206: length 26.1
  Top Layer w0.254: MOTORE_SX.4 119.37,57.21 D5.1 107.93,56.19 106.92,56.19 101.08,62.03 101.08,64.57 100.05,65.6 U2.15
$1N33216: length 24
  Top Layer w0.254: MOTORE_SX.3 118.14,58.48 D4.1 112.13,58.48 v1(110.6,60) ; v1(103.59,66.25) U2.16
  Bottom Layer w0.254: v1(103.59,66.25) 109.84,60 v1(110.6,60)
$1N34380: length 25.6
  Top Layer w0.254: 114.83,40.27 v1(114.83,41.54) ; 114.83,40.27 D7.1 ; 114.83,40.27 MOTORE_BL1.3 ; 103.19,53.86 103.22,53.9 103.91,53.9 104.67,53.14 v1(104.67,51.96)
  Bottom Layer w0.254: v1(104.67,51.96) 114.83,41.8 v1(114.83,41.54)
$1N34384: length 30
  Top Layer w0.254: MOTORE_BL1.4 119.41,37.69 D8.1 108.95,38.45 v1(108.19,39.22) ; v1(101.58,50.14) 101.08,50.65 101.08,51.15 102.49,52.56 103.19,52.56
  Bottom Layer w0.254: v1(101.58,50.14) 108.19,43.53 v1(108.19,39.22)
$1N34389: length 33.1
  Top Layer w0.254: v1(102.47,40.28) 107.3,35.45 D9.1 119.42,35.19 MOTORE_BL1.5 ; v1(101.71,50.94) 101.71,51.2 102.47,51.96 103.14,51.96 103.19,51.92
  Bottom Layer w0.254: v1(101.71,50.94) 101.46,50.94 100.95,50.44 100.95,41.8 v1(102.47,40.28)
$1N34420: length 51.2
  Top Layer w0.254: 103.19,51.27 105.96,51.27 109.84,47.38 109.84,46.26 109.99,46.11 116.7,46.11 118.73,44.08 119.75,44.08 120.76,43.07 120.76,21.98 MOTORE_BL2.3 117.97,19.19 D10.1
$1N34426: length 46
  Top Layer w0.254: 109.08,18.21 108.95,18.18 ; 109.08,18.21 MOTORE_BL2.4 ; 109.08,18.21 109.08,19.23 v1(108.82,19.48) ; 103.19,50.61 103.33,50.47 v1(104.34,50.47)
  Bottom Layer w0.254: v1(108.82,19.48) 108.82,44.63 104.34,49.11 v1(104.34,50.47)
$1N34436: length 49.8
  Top Layer w0.254: v1(106.28,17.16) 107.3,16.15 D12.1 119.42,15.64 MOTORE_BL2.5 ; 103.19,49.97 102.26,49.97 101.97,49.67 101.97,44.34 v1(103.24,43.07)
  Bottom Layer w0.254: v1(103.24,43.07) 106.28,40.02 v1(106.28,17.16)
$1N34966: length 32.8
  Top Layer w0.254: SONAR_CN1.1 53.36,86.55 62.76,77.15 62.76,65.98 63.27,65.47 64.01,65.47 U4.17
$1N34975: length 37
  Top Layer w0.254: v1(65.26,71.06) 65.26,87.31 59.67,92.9 59.67,93.92 58.91,94.68 57.13,94.68 SONAR_CN1.2 ; U4.16 65.16,66.13 66.02,66.99 66.02,69.28 v1(66.53,69.79)
  Bottom Layer w0.254: v1(65.26,71.06) v1(66.53,69.79)
$1N34985: length 37.1
  Top Layer w0.254: U4.15 64.96,66.78 v1(65.38,67.19) ; SONAR_DX1.1 66.36,91.88 v1(66.36,74.61)
  Bottom Layer w0.254: v1(65.38,67.19) 71.69,67.19 71.94,67.45 71.94,69.02 v1(66.36,74.61)
$1N34995: length 29.1
  Top Layer w0.254: U4.14 64.78,67.43 65.18,67.83 65.18,69.35 67.08,71.25 67.08,90.11 SONAR_DX1.2

## Copper pours and planes (outline as drawn; the poured copper is in the pictures)
GND on Bottom Layer: 0.62,96.33 0.63,96.59 0.68,96.93 0.77,97.27 0.9,97.59 1.07,97.9 1.27,98.19 1.5,98.45 1.76,98.68 2.05,98.88 2.35,99.05 2.68,99.17 3.01,99.27 3.36,99.32 3.62,99.33 123.86,99.33 124.12,99.32 124.46,99.27 124.8,99.17 125.13,99.05 125.43,98.88 125.72,98.68 125.98,98.45 126.21,98.19 126.41,97.9 126.58,97.59 126.71,97.27 126.8,96.93 126.85,96.59 126.86,96.33 126.86,3.65 126.85,3.39 126.8,3.04 126.71,2.7 126.58,2.38 126.41,2.07 126.21,1.79 125.98,1.53 125.72,1.29 125.43,1.09 125.13,0.93 124.8,0.8 124.46,0.71 124.12,0.66 123.86,0.65 3.62,0.65 3.36,0.66 3.01,0.71 2.68,0.8 2.35,0.93 2.05,1.09 1.76,1.29 1.5,1.53 1.27,1.79 1.07,2.07 0.9,2.38 0.77,2.7 0.68,3.04 0.63,3.39 0.62,3.65
